# Altium project ttc2_project.prjpcb (part 1 of 2)
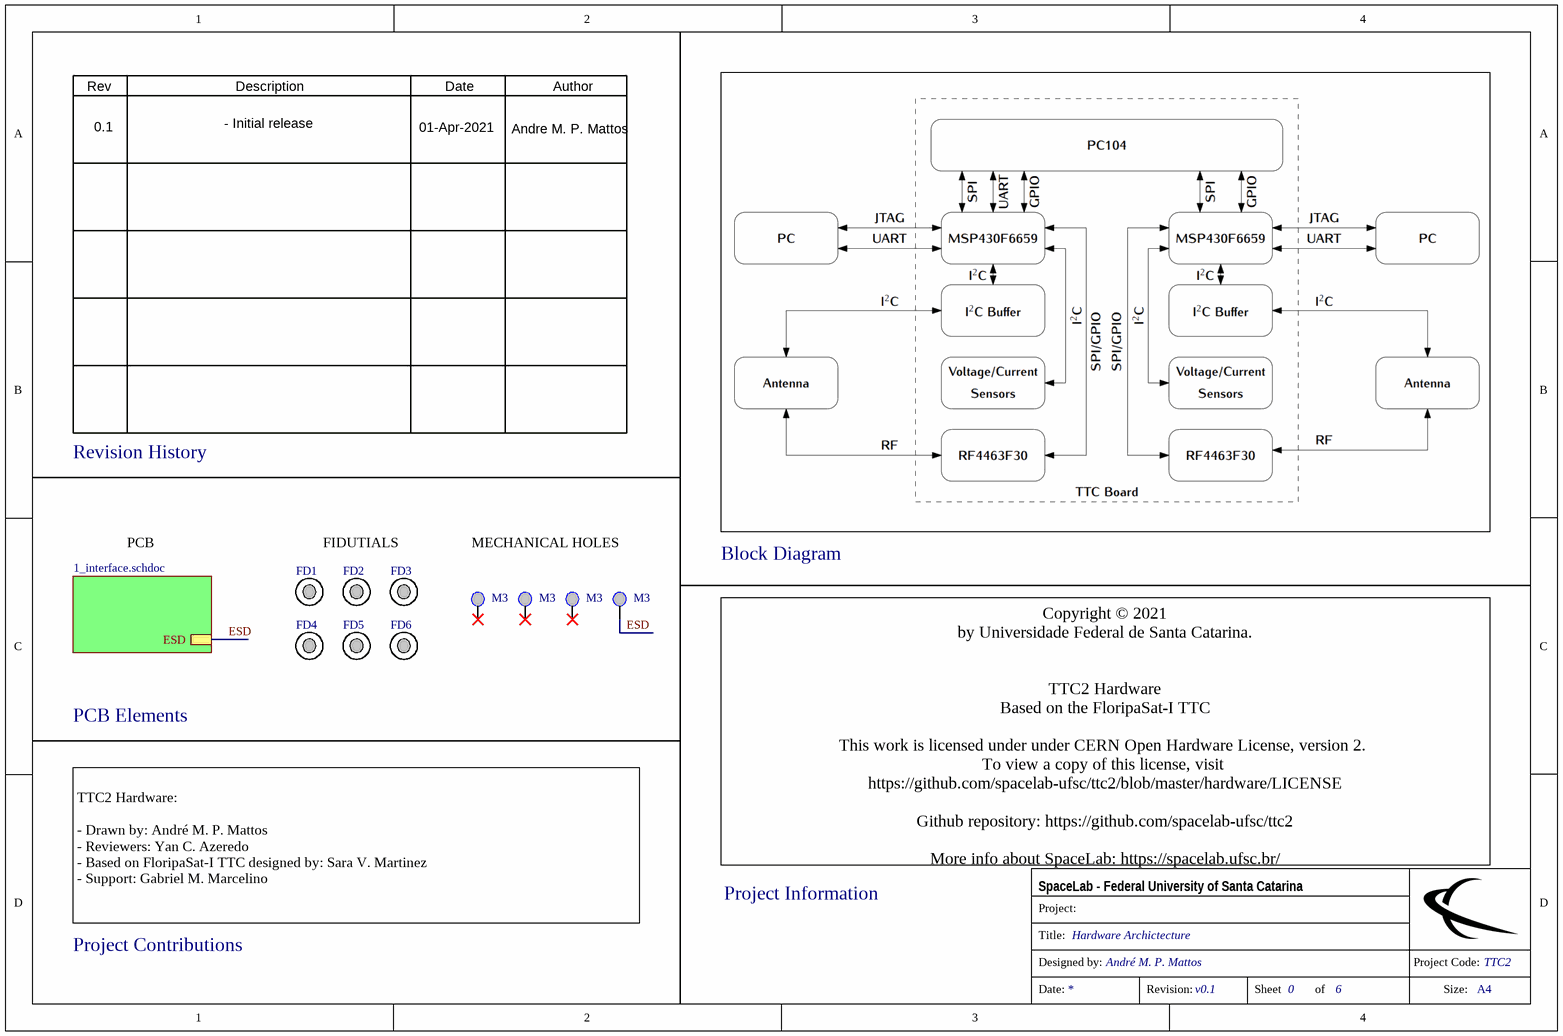
[diagram p0: 0_architecture.schdoc]
DesignedBy: André M. P. Mattos; ProjectCode: TTC2; ProjectRevision: v0.1
7 sheets, 168 parts. Net scope: hierarchical (ports join the sheet entries above them; power ports are global).
Board file: board_layout.pcbdoc
Sheets:
  0_architecture.schdoc
    Interface = 1_interface.schdoc
      INTERFACE = 2_topology.schdoc
        MCU RADIO 0 = 3_mcu_radio_0.schdoc
        Radio 0 (RF4463F30) = 5_radio_0.schdoc
        MCU RADIO 1 = 4_mcu_radio_1.schdoc
        Radio 1 (RF4463F30) = 6_radio_1.schdoc

## Sheet 0_architecture.schdoc: Hardware Archictecture
size A4; Revision: v0.1; SheetNumber: 0; SheetTotal: 6; ProjectCode: TTC2; Designed by: André M. P. Mattos; Version: v0.1

### Parts
FD1  Fiducial 1.3  [Fiducial 1.3mm]  (value not drawn)  (no BOM)
FD2  Fiducial 1.3  [Fiducial 1.3mm]  (value not drawn)  (no BOM)
FD3  Fiducial 1.3  [Fiducial 1.3mm]  (value not drawn)  (no BOM)
FD4  Fiducial 1.3  [Fiducial 1.3mm]  (value not drawn)  (no BOM)
FD5  Fiducial 1.3  [Fiducial 1.3mm]  (value not drawn)  (no BOM)
FD6  Fiducial 1.3  [Fiducial 1.3mm]  (value not drawn)  (no BOM)
MEC1  M3  [M3 hole]  (no BOM)
MEC2  M3  [M3 hole]  (no BOM)
MEC3  M3  [M3 hole]  (no BOM)
MEC4  M3  [M3 hole]  (no BOM)

### Sub-sheets
Interface = 1_interface.schdoc: ESD

### Nets
ESD: MEC4.0 ; sheet Interface/ESD

Not connected (* = marked no-connect by the designer): MEC1 0*; MEC2 0*; MEC3 0*

### Notes on the sheet
- Rev
- Description
- Date
- Author
- 0.1
- - Initial release
- 01-Apr-2021
- Andre M. P. Mattos
- Revision History
- PCB
- FIDUTIALS
- MECHANICAL HOLES
- Block Diagram
- PCB Elements
- TTC2 Hardware:
  - Drawn by: André M. P. Mattos
  - Reviewers: Yan C. Azeredo
  - Based on FloripaSat-I TTC designed by: Sara V. Martinez
  - Support: Gabriel M. Marcelino
- Copyright © 2021
  by Universidade Federal de Santa Catarina.
  TTC2 Hardware
  Based on the FloripaSat-I TTC
  This work is licensed under under CERN Open Hardware License, version 2.
  To view a copy of this license, visit
  https://github.com/spacelab-ufsc/ttc2/blob/master/hardware/LICENSE
  Github repository: https://github.com/spacelab-ufsc/ttc2
  More info about SpaceLab: https://spacelab.ufsc.br/
- Project Information
- Project Contributions
- Project:
- SpaceLab - Federal University of Santa Catarina
- Title:
- Designed by:
- Project Code:
- Date:
- Revision:
- Sheet
- of
- Size:
- A4

### Library data of the parts
FD1-FD6 = Fiducial 1.3: Fiducial 1.3mm
MEC1-MEC4 = M3 hole

## Sheet 1_interface.schdoc: Interface
size A3; DrawnBy: André M. P. Mattos; SheetNumber: 1; SheetTotal: 6; ProjectCode: TTC2; DesignedBy: André M. P. Mattos; ProjectRevision: v0.1; Rule: PcbType=ProtelPcb
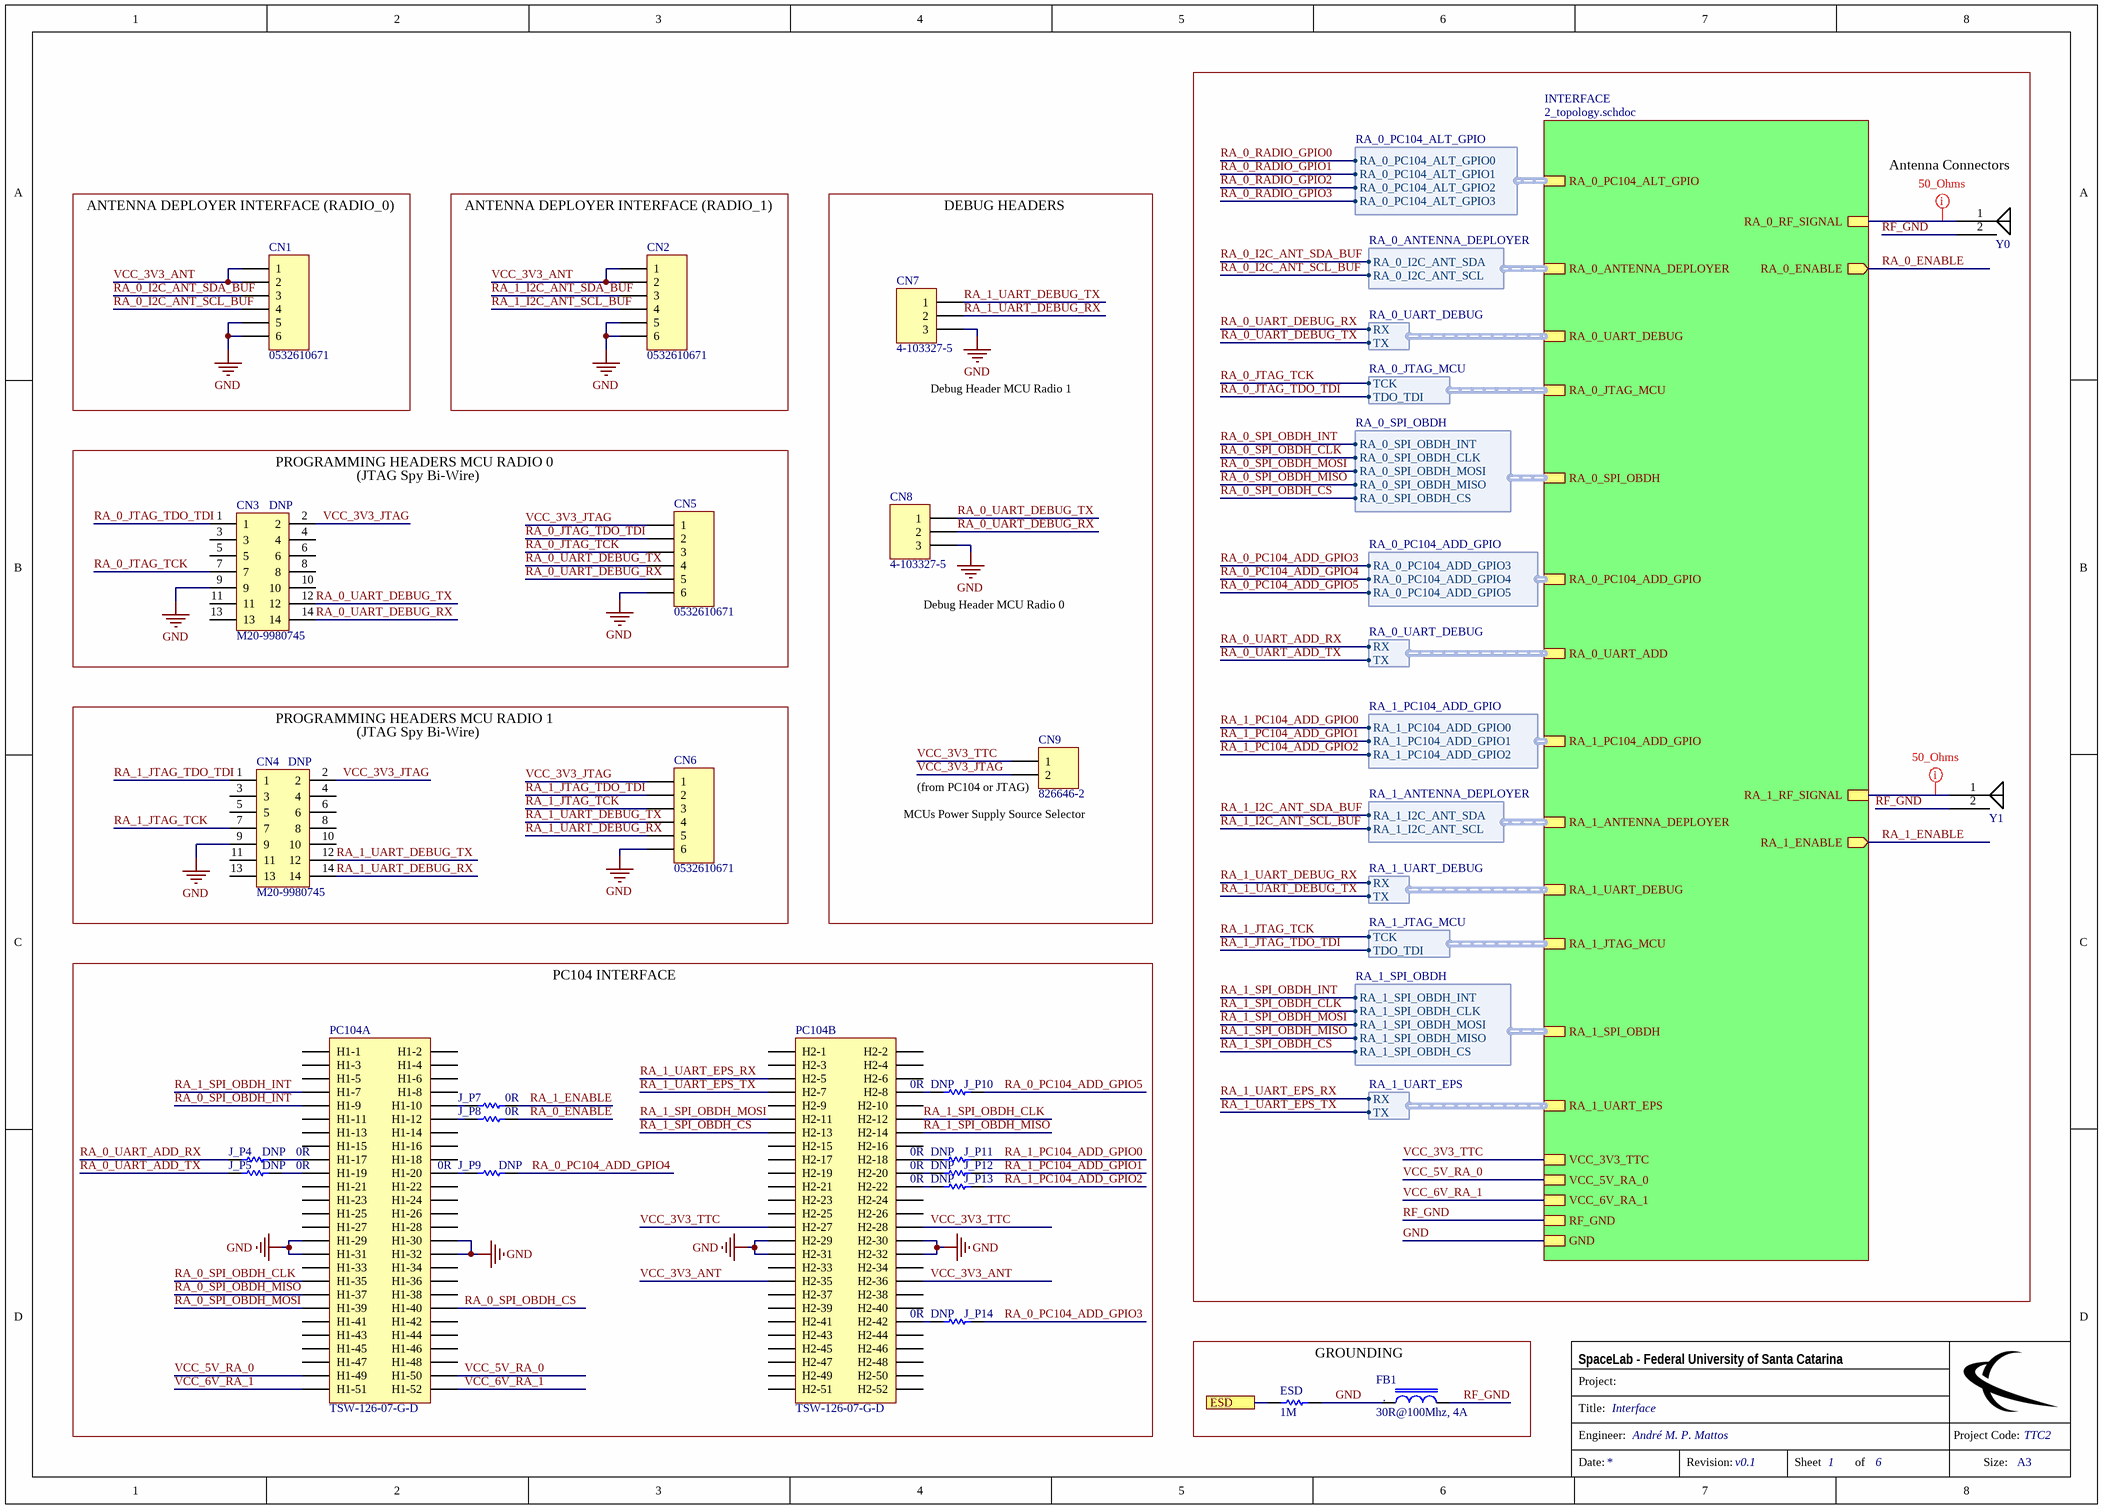
[diagram p1: 1_interface.schdoc]

### Parts
CN1  0532610671  [PICOBLADE 6PIN Right Angle]
CN2  0532610671  [PICOBLADE 6PIN Right Angle]
CN3  M20-9980745  [CONN HEADER VERT 14POS 2.54MM]
CN4  M20-9980745  [CONN HEADER VERT 14POS 2.54MM]
CN5  0532610671  [PICOBLADE 6PIN Right Angle]
CN6  0532610671  [PICOBLADE 6PIN Right Angle]
CN7  4-103327-5  [HDR 1X3]
CN8  4-103327-5  [HDR 1X3]
CN9  826646-2  [HDR 1X2]
ESD  1M  [0805]
FB1  30R@100Mhz, 4A  [IND0805]
J_P4  0R  [0805]
J_P5  0R  [0805]
J_P7  0R  [0805]
J_P8  0R  [0805]
J_P9  0R  [0805]
J_P10  0R  [0805]
J_P11  0R  [0805]
J_P12  0R  [0805]
J_P13  0R  [0805]
J_P14  0R  [0805]
PC104  TSW-126-07-G-D  [PC104_TTC]  (parts A,B of 2)
Y0  Coaxial_Connectors_90º  [CONN MCX JACK  R/A  50 OHM SMD]  (value not drawn)
Y1  Coaxial_Connectors_90º  [CONN MCX JACK  R/A  50 OHM SMD]  (value not drawn)

### Blocks framed on the sheet
Antenna Connectors: Y0 Y1
ANTENNA DEPLOYER INTERFACE (RADIO_0): CN1
ANTENNA DEPLOYER INTERFACE (RADIO_1): CN2
DEBUG HEADERS: CN7-CN9
PC104 INTERFACE: J_P4 J_P5 J_P7-J_P14 PC104
GROUNDING: ESD FB1

### Sub-sheets
INTERFACE = 2_topology.schdoc: RA_0_ANTENNA_DEPLOYER (harness RA_0_ANTENNA_DEPLOYER), RA_0_UART_DEBUG (harness RA_0_UART_DEBUG), RA_0_JTAG_MCU (harness RA_0_JTAG_MCU), RA_0_PC104_ALT_GPIO (harness RA_0_PC104_ALT_GPIO), RA_0_PC104_ADD_GPIO (harness RA_0_PC104_ADD_GPIO), RA_0_UART_ADD (harness RA_0_UART_DEBUG), RA_1_ANTENNA_DEPLOYER (harness RA_1_ANTENNA_DEPLOYER), RA_1_UART_DEBUG (harness RA_1_UART_DEBUG), RA_1_JTAG_MCU (harness RA_1_JTAG_MCU), RA_1_SPI_OBDH (harness RA_1_SPI_OBDH), RA_1_PC104_ADD_GPIO (harness RA_1_PC104_ADD_GPIO), RA_1_UART_EPS (harness RA_1_UART_EPS), RA_0_RF_SIGNAL, RA_1_RF_SIGNAL, RA_0_ENABLE (out), RA_1_ENABLE (out), VCC_3V3_TTC, VCC_5V_RA_0, VCC_6V_RA_1, RF_GND, GND, RA_0_SPI_OBDH (harness RA_0_SPI_OBDH)

### Ports
ESD

### Harnesses
RA_0_PC104_ALT_GPIO: RA_0_PC104_ALT_GPIO3, RA_0_PC104_ALT_GPIO2, RA_0_PC104_ALT_GPIO1, RA_0_PC104_ALT_GPIO0
RA_0_ANTENNA_DEPLOYER: RA_0_I2C_ANT_SCL, RA_0_I2C_ANT_SDA
RA_0_UART_DEBUG: TX, RX
RA_0_JTAG_MCU: TDO_TDI, TCK
RA_1_PC104_ADD_GPIO: RA_1_PC104_ADD_GPIO2, RA_1_PC104_ADD_GPIO1, RA_1_PC104_ADD_GPIO0
RA_1_ANTENNA_DEPLOYER: RA_1_I2C_ANT_SCL, RA_1_I2C_ANT_SDA
RA_1_UART_DEBUG: TX, RX
RA_1_JTAG_MCU: TDO_TDI, TCK
RA_1_SPI_OBDH: RA_1_SPI_OBDH_CLK, RA_1_SPI_OBDH_MOSI, RA_1_SPI_OBDH_MISO, RA_1_SPI_OBDH_CS, RA_1_SPI_OBDH_INT
RA_1_UART_EPS: TX, RX
RA_0_PC104_ADD_GPIO: RA_0_PC104_ADD_GPIO5, RA_0_PC104_ADD_GPIO4, RA_0_PC104_ADD_GPIO3
RA_0_SPI_OBDH: RA_0_SPI_OBDH_CLK, RA_0_SPI_OBDH_MOSI, RA_0_SPI_OBDH_MISO, RA_0_SPI_OBDH_CS, RA_0_SPI_OBDH_INT

### Nets
GND: CN1.5 CN1.6 CN2.5 CN2.6 CN3.9 CN4.9 CN5.6 CN6.6 CN7.3 CN8.3 ESD.1 FB1.1 PC104.H1-29 PC104.H1-30 PC104.H1-31 PC104.H1-32 PC104.H2-29 PC104.H2-30 PC104.H2-31 PC104.H2-32 ; sheet INTERFACE/GND
VCC_3V3_TTC: CN9.1 PC104.H2-27 PC104.H2-28 ; sheet INTERFACE/VCC_3V3_TTC
VCC_5V_RA_0: PC104.H1-49 PC104.H1-50 ; sheet INTERFACE/VCC_5V_RA_0
VCC_6V_RA_1: PC104.H1-51 PC104.H1-52 ; sheet INTERFACE/VCC_6V_RA_1
ESD: ESD.2 ; port ESD
RA_0_ENABLE: J_P8.1 ; sheet INTERFACE/RA_0_ENABLE
RA_0_I2C_ANT_SCL_BUF: CN1.4 ; sheet INTERFACE/RA_0_ANTENNA_DEPLOYER.RA_0_I2C_ANT_SCL
RA_0_I2C_ANT_SDA_BUF: CN1.3 ; sheet INTERFACE/RA_0_ANTENNA_DEPLOYER.RA_0_I2C_ANT_SDA
RA_0_JTAG_TCK: CN3.7 CN5.3 ; sheet INTERFACE/RA_0_JTAG_MCU.TCK
RA_0_JTAG_TDO_TDI: CN3.1 CN5.2 ; sheet INTERFACE/RA_0_JTAG_MCU.TDO_TDI
RA_0_PC104_ADD_GPIO3: J_P14.1 ; sheet INTERFACE/RA_0_PC104_ADD_GPIO.RA_0_PC104_ADD_GPIO3
RA_0_PC104_ADD_GPIO4: J_P9.1 ; sheet INTERFACE/RA_0_PC104_ADD_GPIO.RA_0_PC104_ADD_GPIO4
RA_0_PC104_ADD_GPIO5: J_P10.1 ; sheet INTERFACE/RA_0_PC104_ADD_GPIO.RA_0_PC104_ADD_GPIO5
RA_0_RF_SIGNAL: Y0.1 ; sheet INTERFACE/RA_0_RF_SIGNAL
RA_0_SPI_OBDH_CLK: PC104.H1-35 ; sheet INTERFACE/RA_0_SPI_OBDH.RA_0_SPI_OBDH_CLK
RA_0_SPI_OBDH_CS: PC104.H1-40 ; sheet INTERFACE/RA_0_SPI_OBDH.RA_0_SPI_OBDH_CS
RA_0_SPI_OBDH_INT: PC104.H1-9 ; sheet INTERFACE/RA_0_SPI_OBDH.RA_0_SPI_OBDH_INT
RA_0_SPI_OBDH_MISO: PC104.H1-37 ; sheet INTERFACE/RA_0_SPI_OBDH.RA_0_SPI_OBDH_MISO
RA_0_SPI_OBDH_MOSI: PC104.H1-39 ; sheet INTERFACE/RA_0_SPI_OBDH.RA_0_SPI_OBDH_MOSI
RA_0_UART_ADD_RX: J_P4.2 ; sheet INTERFACE/RA_0_UART_ADD.RX
RA_0_UART_ADD_TX: J_P5.2 ; sheet INTERFACE/RA_0_UART_ADD.TX
RA_0_UART_DEBUG_RX: CN3.14 CN5.5 CN8.2 ; sheet INTERFACE/RA_0_UART_DEBUG.RX
RA_0_UART_DEBUG_TX: CN3.12 CN5.4 CN8.1 ; sheet INTERFACE/RA_0_UART_DEBUG.TX
RA_1_ENABLE: J_P7.1 ; sheet INTERFACE/RA_1_ENABLE
RA_1_I2C_ANT_SCL_BUF: CN2.4 ; sheet INTERFACE/RA_1_ANTENNA_DEPLOYER.RA_1_I2C_ANT_SCL
RA_1_I2C_ANT_SDA_BUF: CN2.3 ; sheet INTERFACE/RA_1_ANTENNA_DEPLOYER.RA_1_I2C_ANT_SDA
RA_1_JTAG_TCK: CN4.7 CN6.3 ; sheet INTERFACE/RA_1_JTAG_MCU.TCK
RA_1_JTAG_TDO_TDI: CN4.1 CN6.2 ; sheet INTERFACE/RA_1_JTAG_MCU.TDO_TDI
RA_1_PC104_ADD_GPIO0: J_P11.1 ; sheet INTERFACE/RA_1_PC104_ADD_GPIO.RA_1_PC104_ADD_GPIO0
RA_1_PC104_ADD_GPIO1: J_P12.1 ; sheet INTERFACE/RA_1_PC104_ADD_GPIO.RA_1_PC104_ADD_GPIO1
RA_1_PC104_ADD_GPIO2: J_P13.1 ; sheet INTERFACE/RA_1_PC104_ADD_GPIO.RA_1_PC104_ADD_GPIO2
RA_1_RF_SIGNAL: Y1.1 ; sheet INTERFACE/RA_1_RF_SIGNAL
RA_1_SPI_OBDH_CLK: PC104.H2-12 ; sheet INTERFACE/RA_1_SPI_OBDH.RA_1_SPI_OBDH_CLK
RA_1_SPI_OBDH_CS: PC104.H2-13 ; sheet INTERFACE/RA_1_SPI_OBDH.RA_1_SPI_OBDH_CS
RA_1_SPI_OBDH_INT: PC104.H1-7 ; sheet INTERFACE/RA_1_SPI_OBDH.RA_1_SPI_OBDH_INT
RA_1_SPI_OBDH_MISO: PC104.H2-14 ; sheet INTERFACE/RA_1_SPI_OBDH.RA_1_SPI_OBDH_MISO
RA_1_SPI_OBDH_MOSI: PC104.H2-11 ; sheet INTERFACE/RA_1_SPI_OBDH.RA_1_SPI_OBDH_MOSI
RA_1_UART_DEBUG_RX: CN4.14 CN6.5 CN7.2 ; sheet INTERFACE/RA_1_UART_DEBUG.RX
RA_1_UART_DEBUG_TX: CN4.12 CN6.4 CN7.1 ; sheet INTERFACE/RA_1_UART_DEBUG.TX
RA_1_UART_EPS_RX: PC104.H2-5 ; sheet INTERFACE/RA_1_UART_EPS.RX
RA_1_UART_EPS_TX: PC104.H2-7 ; sheet INTERFACE/RA_1_UART_EPS.TX
RF_GND: FB1.2 Y0.2 Y1.2 ; sheet INTERFACE/RF_GND
VCC_3V3_ANT: CN1.1 CN1.2 CN2.1 CN2.2 PC104.H2-35 PC104.H2-36
VCC_3V3_JTAG: CN3.2 CN4.2 CN5.1 CN6.1 CN9.2
NetJ_P4_1: J_P4.1 PC104.H1-17
NetJ_P5_1: J_P5.1 PC104.H1-19
NetJ_P7_2: J_P7.2 PC104.H1-10
NetJ_P8_2: J_P8.2 PC104.H1-12
NetJ_P9_2: J_P9.2 PC104.H1-20
NetJ_P10_2: J_P10.2 PC104.H2-8
NetJ_P11_2: J_P11.2 PC104.H2-18
NetJ_P12_2: J_P12.2 PC104.H2-20
NetJ_P13_2: J_P13.2 PC104.H2-22
NetJ_P14_2: J_P14.2 PC104.H2-42

Not connected (* = marked no-connect by the designer): CN3 3 4 5 6 8 10 11 13; CN4 3 4 5 6 8 10 11 13; PC104 H1-1 H1-2 H1-3 H1-4 H1-5 H1-6 H1-8 H1-11 H1-13 H1-14 H1-15 H1-16 H1-18 H1-21 H1-22 H1-23 H1-24 H1-25 H1-26 H1-27 H1-28 H1-33 H1-34 H1-36 H1-38 H1-41 H1-42 H1-43 H1-44 H1-45 H1-46 H1-47 H1-48 H2-1 H2-2 H2-3 H2-4 H2-6 H2-9 H2-10 H2-15 H2-16 H2-17 H2-19 H2-21 H2-23 H2-24 H2-25 H2-26 H2-33 H2-34 H2-37 H2-38 H2-39 H2-40 H2-41 H2-43 H2-44 H2-45 H2-46 H2-47 H2-48 H2-49 H2-50 H2-51 H2-52

### Layout directives
net class 50Ohm_Net: RA_0_RF_SIGNAL, RA_1_RF_SIGNAL

### Notes on the sheet
- Debug Header MCU Radio 1
- (near CN3) DNP
- (near CN3) PROGRAMMING HEADERS MCU RADIO 0
- (JTAG Spy Bi-Wire)
- Debug Header MCU Radio 0
- (near CN4) PROGRAMMING HEADERS MCU RADIO 1
- (near CN4) DNP
- (near CN9) MCUs Power Supply Source Selector
- (near CN9) (from PC104 or JTAG)
- (near J_P10) DNP
- (near J_P4) DNP
- DNP
- (near J_P9) DNP
- (near J_P11) DNP
- (near J_P14) DNP
- Project:
- SpaceLab - Federal University of Santa Catarina
- Title:
- Engineer:
- Project Code:
- Date:
- Revision:
- Sheet
- of
- Size:
- A3
- (in symbol FB_30R_4A_100MHz_0805) .

### Library data of the parts
CN1 CN2 CN5 CN6 = 0532610671: PicoBlade 6 Position Right Angle Connector Header Surface Mount  0.049" (1.25mm); LatestRevisionDate: 17-Jul-2002; LatestRevisionNote: Re-released for DXP Platform.; Publisher: Altium Limited; Partnumber: 0532610671
CN3 CN4 = M20-9980745: Connector Header Through Hole 14 position 0.100" (2.54mm); Manufacturer: Harwin; Number of Contacts: 14; Contact Resistance: 25mR; Max Current Rating: 3A; Gender: Male; Connector Type: Male Pin; Row Spacing: 0.1inch; Supplier 1: Digi-Key; Supplier Part Number 1: 952-1932-ND; Stock 1: 15564; Pricing 1: 1=0.54, 10=0.51, 100=0.391, 500=0.34, 1000=0.2805, 5000=0.2465, 10000=0.2295 (USD); Mount: Through Hole; Contact Plating: Gold; Contact Material: Brass; Color: Black; Housing Color: Black; Housing Material: Nylon; Min Operating Temperature: -40°C; Max Operating Temperature: 105°C; Number of Rows: 2; Termination: Solder; Package Quantity: 500; Packaging: Bag; Number of Positions: 14; Orientation: Straight; Length: 17.78mm; Pitch: 2.54mm; Contact Mating Length: 0.24inch; Depth: 5.08mm; Radiation Hardening: No; REACH SVHC: No SVHC; ComponentLink1URL: https://www.verical.com/server-webapp/html/getDatasheet?partID=468550&src-supplier=Verical; ComponentLink1Description: https://www.verical.com/server-webapp/html/getDatasheet?partID=468550&src-supplier=Verical; ComponentLink2URL: http://www.harwin.com/include/downloads/drawings/M20-998.PDF?src-supplier=Element14; ComponentLink2Description: http://www.harwin.com/include/downloads/drawings/M20-998.PDF?src-supplier=Element14; ComponentLink3URL: http://www.mouser.com/ds/2/181/M20-998-351176.pdf?src-supplier=Mouser; ComponentLink3Description: http://www.mouser.com/ds/2/181/M20-998-351176.pdf?src-supplier=Mouser; Supplier 2: Mouser; Supplier Part Number 2: 855-M20-9980745; Stock 2: 1790; Pricing 2: 1=0.54, 10=0.51, 100=0.387, 500=0.34, 1000=0.28, 2500=0.246 (USD); Manufacturer Part Number: M20-9980745
CN7 CN8 = 4-103327-5: Connector Header Through Hole 3 position 0.100" (2.54mm); Manufacturer: TE Connectivity AMP; Number of Contacts: 3; Connector Type: Plug,Header,Pin; Current Rating: 3A; Insulation Resistance: 5GR; Board Standoff: No (Without); High Speed Serial Data Connector: No; PCB Mount Retention: Without; PCB Mounting Orientation: Vertical; Contact Post Length: 0.12inch; Approvals: CSA; Fitted: Yes (eng model only); LatestRevisionDate: 17-Jul-2002; LatestRevisionNote: Re-released for DXP Platform.; Publisher: Altium Limited; Partnumber: 4-103327-5; Supplier 1: Mouser; Supplier Part Number 1: 571-4-103327-5; Stock 1: 2961; Pricing 1: 1=0.26, 10=0.182, 100=0.157, 500=0.15, 1000=0.125, 2500=0.107 (USD); Mount: Through Hole; Contact Plating: Tin; Contact Material: Bronze; Housing Color: Black; Housing Material: Thermoplastic; Contact Shape: Square; Min Operating Temperature: -65°C; Max Operating Temperature: 105°C; Number of Rows: 1; Termination: Through Hole; Packaging: Carton; Package Quantity: 540; Number of Positions: 3; Contact Gender: Male; Orientation: Straight; Contact Protection: No (Without); Gasket: No (Without); High Temperature Housing: No; Keyed: No; Mating Connector Lock: No (Without); Selectively Loaded: No (Without); Stabilizers: No (Without); Strain Relief: No (Without); Contact Current Rating: 3A; Length: 7.21mm; Pitch: 2.54mm; Contact Mating Length: 0.23inch; Row Spacing: 2.54mm; Depth: 2.34mm; Radiation Hardening: No; ELV: Compliant; Flammability Rating: UL94 V-0; Supplier 2: Digi-Key; Supplier Part Number 2: A128778-ND; Stock 2: 16328; Pricing 2: 1=0.26, 10=0.25, 100=0.1753, 500=0.1503, 1000=0.12525, 5000=0.10736, 10000=0.1002 (USD); Manufacturer Part Number: 4-103327-5
CN9 = 826646-2: Connector Header Through Hole 2 position 0.100" (2.54mm); LatestRevisionDate: 17-Jul-2002; LatestRevisionNote: Re-released for DXP Platform.; Publisher: Altium Limited; PartNumber: 826646-2
ESD = R1000k_1%_1/8W_0805: RES 1000K OHM 1/8W 1% 0805; Partnumber: RMCF0805FG1M00; NCM: 8533.21.20
FB1 = FB_30R_4A_100MHz_0805: Ferrite Bead 30 OHM 4A 100MHz; Partnumber: BLM21PG300SN1D; NCM: 8504.50.00
J_P4 J_P5 J_P7-J_P14 = R0R_JUMPER_1/8W_0805: RES 0R OHM 1/8W JUMPER 0805; Partnumber: CRCW08050000Z0EA; NCM: 8533.21.20
PC104 = PC104_TTC: Connector Header Through Hole 52 position 0.100" (2.54mm) - PC104 used in the TTC module; Partnumber: SSW-126-04-G-D; Contact Length - Mating: 5.84mm; Overall Contact Length: 10.92mm; Contact Length - Post: 2.54mm; Insulation Height: 2.54mm; Contact Finish - Mating: Gold; Operating Temperature: -55°C ~ 125°C
Y0 Y1 = Coaxial_Connectors_90º: MCX Connector Jack, Female Socket 50Ohm Through Hole, Right Angle Solder; Partnumber: 133-3701-311

## Sheet 2_topology.schdoc: Topology
size A3; DrawnBy: André M. P. Mattos; Revision: v0.1; SheetNumber: 2; SheetTotal: 6; ProjectCode: TTC2; DesignedBy: André M. P. Mattos
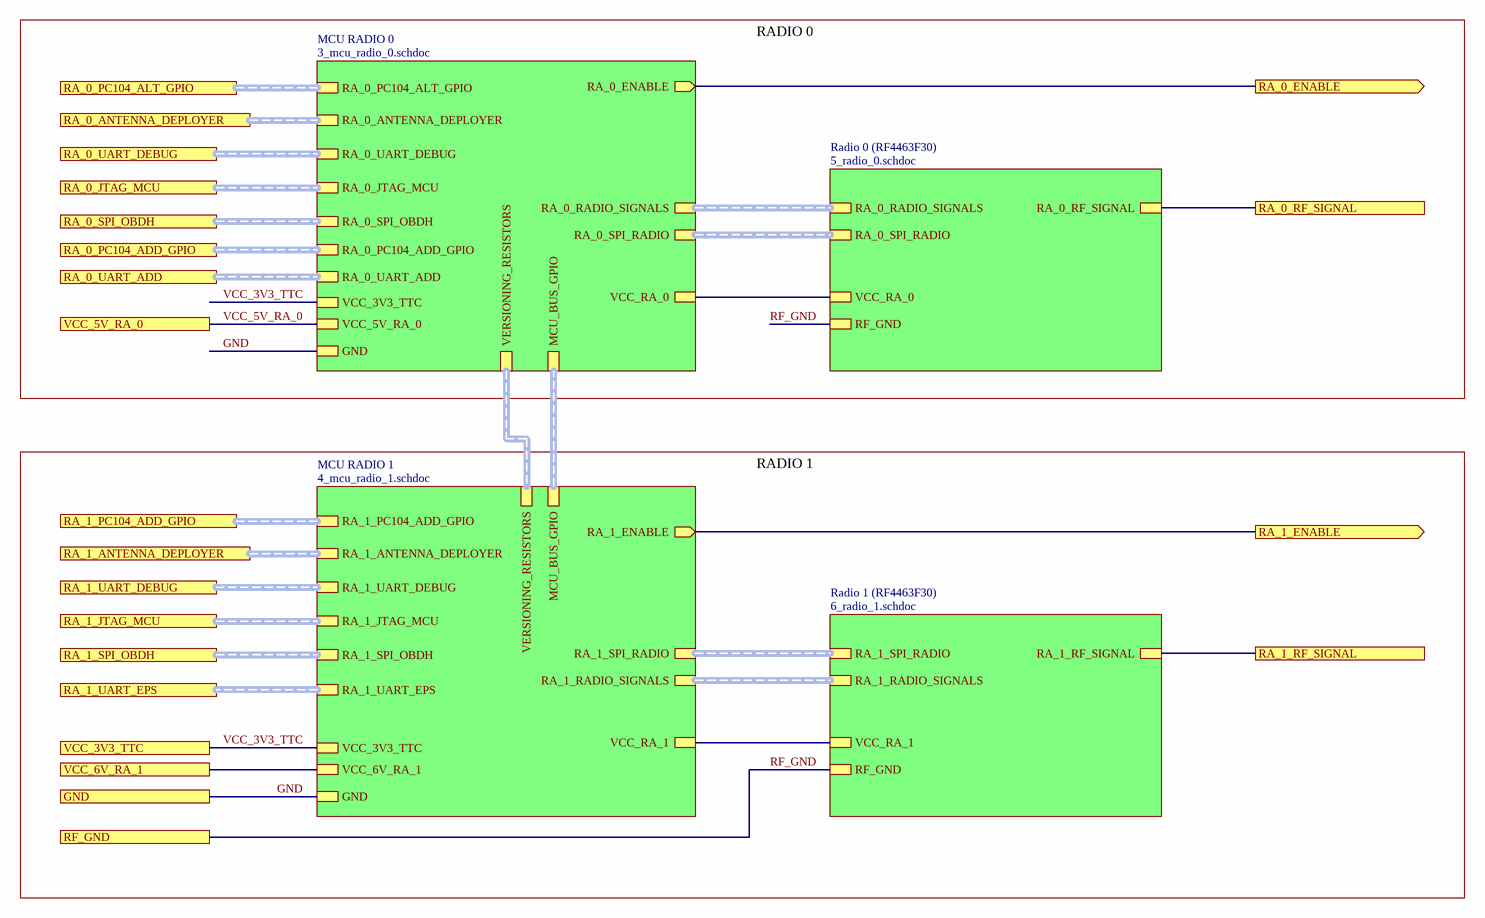
[diagram p2: 2_topology.schdoc]

### Sub-sheets
MCU RADIO 0 = 3_mcu_radio_0.schdoc: VCC_3V3_TTC, GND, RA_0_ENABLE (out), VCC_RA_0, VCC_5V_RA_0, RA_0_ANTENNA_DEPLOYER (harness RA_0_ANTENNA_DEPLOYER), RA_0_JTAG_MCU (harness RA_0_JTAG_MCU), RA_0_UART_DEBUG (harness RA_0_UART_DEBUG), RA_0_RADIO_SIGNALS (harness RA_0_RADIO_SIGNALS), RA_0_SPI_RADIO (harness RA_0_SPI_RADIO), VERSIONING_RESISTORS (harness VERSIONING_RESISTORS), MCU_BUS_GPIO (harness MCU_BUS_GPIO), RA_0_UART_ADD (harness RA_0_UART_ADD), RA_0_SPI_OBDH (harness RA_0_SPI_OBDH), RA_0_PC104_ALT_GPIO (harness RA_0_PC104_ALT_GPIO), RA_0_PC104_ADD_GPIO (harness RA_0_PC104_ADD_GPIO)
MCU RADIO 1 = 4_mcu_radio_1.schdoc: VCC_3V3_TTC, GND, RA_1_ENABLE (out), VCC_RA_1, VCC_6V_RA_1, RA_1_UART_EPS (harness RA_1_UART_EPS), RA_1_PC104_ADD_GPIO (harness RA_1_PC104_ADD_GPIO), RA_1_RADIO_SIGNALS (harness RA_1_RADIO_SIGNALS), RA_1_SPI_RADIO (harness RA_1_SPI_RADIO), RA_1_SPI_OBDH (harness RA_1_SPI_OBDH), VERSIONING_RESISTORS (harness VERSIONING_RESISTORS), RA_1_UART_DEBUG (harness RA_1_UART_DEBUG), RA_1_JTAG_MCU (harness RA_1_JTAG_MCU), RA_1_ANTENNA_DEPLOYER (harness RA_1_ANTENNA_DEPLOYER), MCU_BUS_GPIO (harness MCU_BUS_GPIO)
Radio 0 (RF4463F30) = 5_radio_0.schdoc: RF_GND, RA_0_RF_SIGNAL, VCC_RA_0, RA_0_RADIO_SIGNALS (harness RA_0_RADIO_SIGNALS), RA_0_SPI_RADIO (harness RA_0_SPI_RADIO)
Radio 1 (RF4463F30) = 6_radio_1.schdoc: RF_GND, RA_1_RF_SIGNAL, VCC_RA_1, RA_1_RADIO_SIGNALS (harness RA_1_RADIO_SIGNALS), RA_1_SPI_RADIO (harness RA_1_SPI_RADIO)

### Ports
GND, RA_0_ANTENNA_DEPLOYER (harness RA_0_ANTENNA_DEPLOYER), RA_0_ENABLE (out), RA_0_JTAG_MCU (harness RA_0_JTAG_MCU), RA_0_PC104_ADD_GPIO (harness RA_0_PC104_ADD_GPIO), RA_0_PC104_ALT_GPIO (harness RA_0_PC104_ALT_GPIO), RA_0_RF_SIGNAL, RA_0_SPI_OBDH (harness RA_0_SPI_OBDH), RA_0_UART_ADD (harness RA_0_UART_DEBUG), RA_0_UART_DEBUG (harness RA_0_UART_DEBUG), RA_1_ANTENNA_DEPLOYER (harness RA_1_ANTENNA_DEPLOYER), RA_1_ENABLE (out), RA_1_JTAG_MCU (harness RA_1_JTAG_MCU), RA_1_PC104_ADD_GPIO (harness RA_1_PC104_ADD_GPIO), RA_1_RF_SIGNAL, RA_1_SPI_OBDH (harness RA_1_SPI_OBDH), RA_1_UART_DEBUG (harness RA_1_UART_DEBUG), RA_1_UART_EPS (harness RA_1_UART_EPS), RF_GND, VCC_3V3_TTC, VCC_5V_RA_0, VCC_6V_RA_1

### Nets
GND: port GND, sheet MCU RADIO 0/GND, sheet MCU RADIO 1/GND
RA_0_SENSE_VCC_OUT1: sheet MCU RADIO 0/VCC_RA_0, sheet Radio 0 (RF4463F30)/VCC_RA_0
RA_1_SENSE_VCC_OUT1: sheet MCU RADIO 1/VCC_RA_1, sheet Radio 1 (RF4463F30)/VCC_RA_1
VCC_3V3_TTC: port VCC_3V3_TTC, sheet MCU RADIO 0/VCC_3V3_TTC, sheet MCU RADIO 1/VCC_3V3_TTC
VCC_5V_RA_0: port VCC_5V_RA_0, sheet MCU RADIO 0/VCC_5V_RA_0
VCC_6V_RA_1: port VCC_6V_RA_1, sheet MCU RADIO 1/VCC_6V_RA_1
RA_0_ENABLE: port RA_0_ENABLE, sheet MCU RADIO 0/RA_0_ENABLE
RA_0_RF_SIGNAL: port RA_0_RF_SIGNAL, sheet Radio 0 (RF4463F30)/RA_0_RF_SIGNAL
RA_1_ENABLE: port RA_1_ENABLE, sheet MCU RADIO 1/RA_1_ENABLE
RA_1_RF_SIGNAL: port RA_1_RF_SIGNAL, sheet Radio 1 (RF4463F30)/RA_1_RF_SIGNAL
RF_GND: port RF_GND, sheet Radio 0 (RF4463F30)/RF_GND, sheet Radio 1 (RF4463F30)/RF_GND

### Buses and harness runs
harness port RA_0_ANTENNA_DEPLOYER = sheet MCU RADIO 0/RA_0_ANTENNA_DEPLOYER
harness port RA_0_JTAG_MCU = sheet MCU RADIO 0/RA_0_JTAG_MCU
harness port RA_0_PC104_ADD_GPIO = sheet MCU RADIO 0/RA_0_PC104_ADD_GPIO
harness port RA_0_PC104_ALT_GPIO = sheet MCU RADIO 0/RA_0_PC104_ALT_GPIO
harness port RA_0_SPI_OBDH = sheet MCU RADIO 0/RA_0_SPI_OBDH
harness port RA_0_UART_ADD = sheet MCU RADIO 0/RA_0_UART_ADD
harness port RA_0_UART_DEBUG = sheet MCU RADIO 0/RA_0_UART_DEBUG
harness port RA_1_ANTENNA_DEPLOYER = sheet MCU RADIO 1/RA_1_ANTENNA_DEPLOYER
harness port RA_1_JTAG_MCU = sheet MCU RADIO 1/RA_1_JTAG_MCU
harness port RA_1_PC104_ADD_GPIO = sheet MCU RADIO 1/RA_1_PC104_ADD_GPIO
harness port RA_1_SPI_OBDH = sheet MCU RADIO 1/RA_1_SPI_OBDH
harness port RA_1_UART_DEBUG = sheet MCU RADIO 1/RA_1_UART_DEBUG
harness port RA_1_UART_EPS = sheet MCU RADIO 1/RA_1_UART_EPS
harness sheet MCU RADIO 0/MCU_BUS_GPIO = sheet MCU RADIO 1/MCU_BUS_GPIO
harness sheet MCU RADIO 0/RA_0_RADIO_SIGNALS = sheet Radio 0 (RF4463F30)/RA_0_RADIO_SIGNALS
harness sheet MCU RADIO 0/RA_0_SPI_RADIO = sheet Radio 0 (RF4463F30)/RA_0_SPI_RADIO
harness sheet MCU RADIO 0/VERSIONING_RESISTORS = sheet MCU RADIO 1/VERSIONING_RESISTORS
harness sheet MCU RADIO 1/RA_1_RADIO_SIGNALS = sheet Radio 1 (RF4463F30)/RA_1_RADIO_SIGNALS
harness sheet MCU RADIO 1/RA_1_SPI_RADIO = sheet Radio 1 (RF4463F30)/RA_1_SPI_RADIO

### Notes on the sheet
- RADIO 0
- RADIO 1
- Project:
- SpaceLab - Federal University of Santa Catarina
- Title:
- Engineer:
- Project Code:
- Date:
- Revision:
- Sheet
- of
- Size:
- A3

## Sheet 3_mcu_radio_0.schdoc: MCU Radio 0
size A3; DrawnBy: Sara Vega Martinez; Revision: v0.1; SheetNumber: 3; SheetTotal: 6; DesignedBy: André M. P. Mattos; ProjectRevision: v0.1
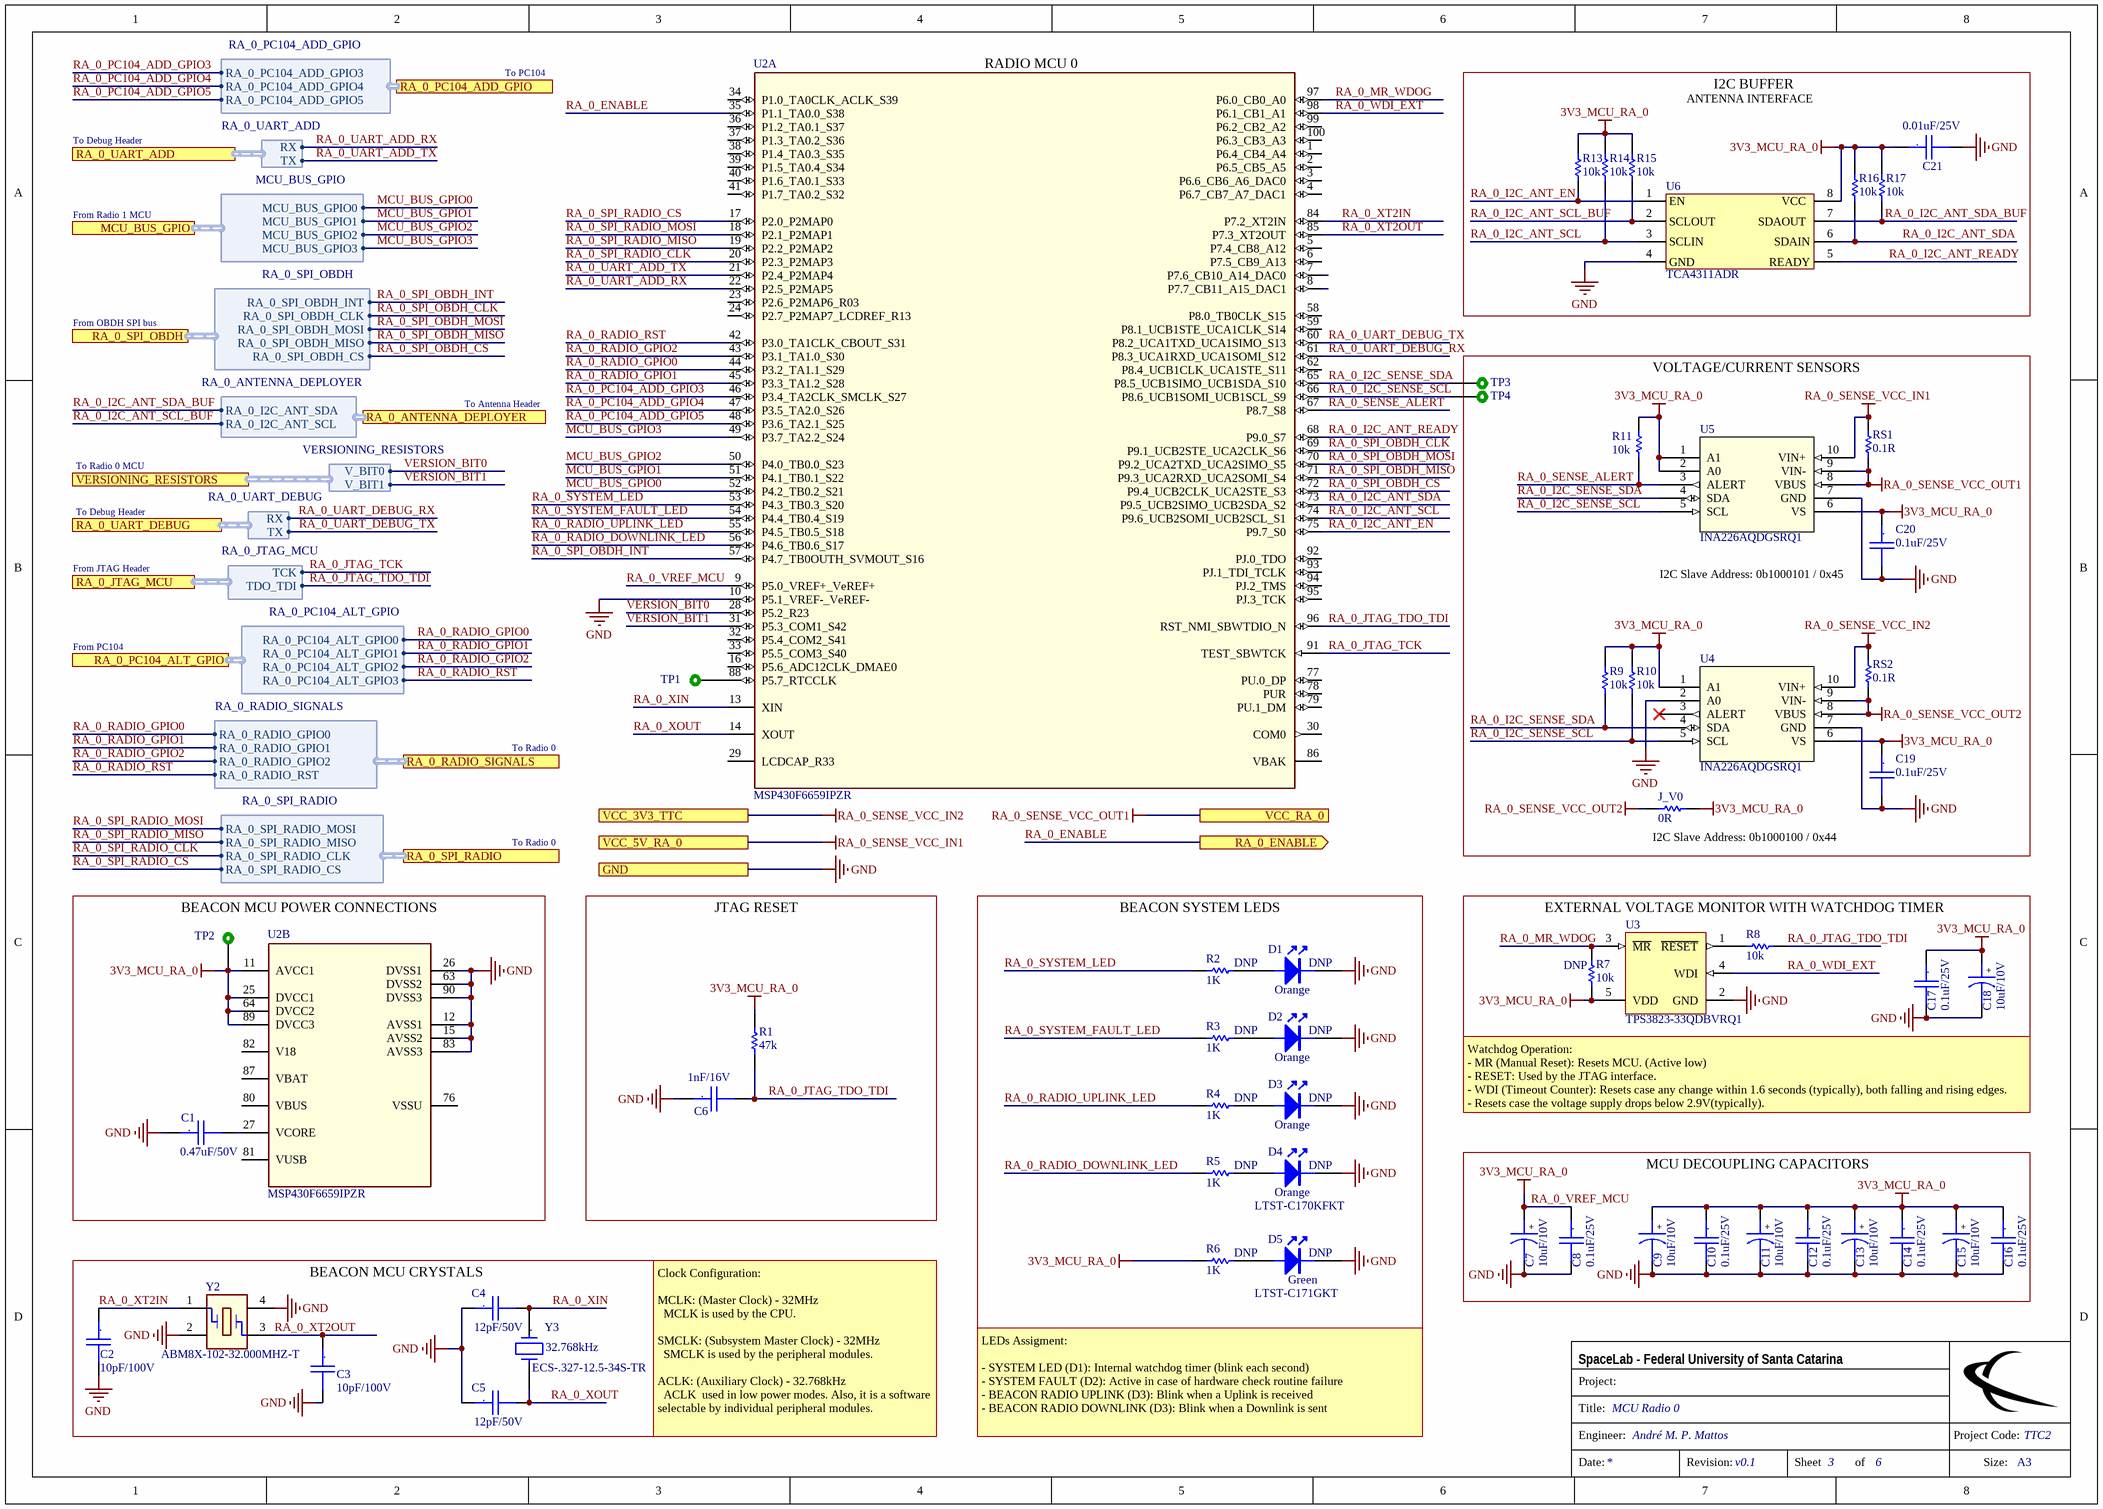
[diagram p3: 3_mcu_radio_0.schdoc]

### Parts
C1  0.47uF/50V  [CC0805]
C2  10pF/100V  [CC0805]
C3  10pF/100V  [CC0805]
C4  12pF/50V  [CC0805]
C5  12pF/50V  [CC0805]
C6  1nF/16V  [CC0603]
C7  10uF/10V  [CC0805_Tantalum]
C8  0.1uF/25V  [CC0805]
C9  10uF/10V  [CC0805_Tantalum]
C10  0.1uF/25V  [CC0805]
C11  10uF/10V  [CC0805_Tantalum]
C12  0.1uF/25V  [CC0805]
C13  10uF/10V  [CC0805_Tantalum]
C14  0.1uF/25V  [CC0805]
C15  10uF/10V  [CC0805_Tantalum]
C16  0.1uF/25V  [CC0805]
C17  0.1uF/25V  [CC0805]
C18  10uF/10V  [CC0805_Tantalum]
C19  0.1uF/25V  [CC0805]
C20  0.1uF/25V  [CC0805]
C21  0.01uF/25V  [CC0805]
D1  LTST-C170KFKT  [0805-ORANGE-LED]  (value not drawn)
D2  LTST-C170KFKT  [0805-ORANGE-LED]  (value not drawn)
D3  LTST-C170KFKT  [0805-ORANGE-LED]  (value not drawn)
D4  LTST-C170KFKT  [0805-ORANGE-LED]
D5  LTST-C171GKT  [0805-GREEN-LED]
J_V0  0R  [0805]
R1  47k  [0805]
R2  1K  [0805]
R3  1K  [0805]
R4  1K  [0805]
R5  1K  [0805]
R6  1K  [0805]
R7  10k  [0805]
R8  10k  [0805]
R9  10k  [0805]
R10  10k  [0805]
R11  10k  [0805]
R13  10k  [0805]
R14  10k  [0805]
R15  10k  [0805]
R16  10k  [0805]
R17  10k  [0805]
RS1  0.1R  [0805]
RS2  0.1R  [0805]
TP1  TEST_POINT  [TEST_POINT]  (value not drawn)  (no BOM)
TP2  TEST_POINT  [TEST_POINT]  (value not drawn)  (no BOM)
TP3  TEST_POINT  [TEST_POINT]  (value not drawn)  (no BOM)
TP4  TEST_POINT  [TEST_POINT]  (value not drawn)  (no BOM)
U2  MSP430F6659IPZR  [LQFP-100]  (parts A,B of 2)
U3  TPS3823-33QDBVRQ1  [DBV0005A_N]
U4  INA226AQDGSRQ1  [DGS10]
U5  INA226AQDGSRQ1  [DGS10]
U6  TCA4311ADR  [SOIC8]
Y2  ABM8X-102-32.000MHZ-T  [XTAL_ABM8X]
Y3  ECS-.327-12.5-34S-TR  [ABS06 0805]

### Blocks framed on the sheet
I2C BUFFER: C21 R13-R17 U6
VOLTAGE/CURRENT SENSORS: C19 C20 J_V0 R9-R11 RS1 RS2 TP3 TP4 U4 U5
BEACON MCU POWER CONNECTIONS: C1 TP2 U2
JTAG RESET: C6 R1
BEACON SYSTEM LEDS: D1-D5 R2-R6
EXTERNAL VOLTAGE MONITOR WITH WATCHDOG TIMER: C17 C18 R7 R8 U3
MCU DECOUPLING CAPACITORS: C7-C16
BEACON MCU CRYSTALS: C2-C5 Y2 Y3

### Ports
GND, MCU_BUS_GPIO (harness MCU_BUS_GPIO), RA_0_ANTENNA_DEPLOYER (harness RA_0_ANTENNA_DEPLOYER), RA_0_ENABLE (out), RA_0_JTAG_MCU (harness RA_0_JTAG_MCU), RA_0_PC104_ADD_GPIO (harness RA_0_PC104_ADD_GPIO), RA_0_PC104_ALT_GPIO (harness RA_0_PC104_ALT_GPIO), RA_0_RADIO_SIGNALS (harness RA_0_RADIO_SIGNALS), RA_0_SPI_OBDH (harness RA_0_SPI_OBDH), RA_0_SPI_RADIO (harness RA_0_SPI_RADIO), RA_0_UART_ADD (harness RA_0_UART_ADD), RA_0_UART_DEBUG (harness RA_0_UART_DEBUG), VCC_3V3_TTC, VCC_5V_RA_0, VCC_RA_0, VERSIONING_RESISTORS (harness VERSIONING_RESISTORS)

### Harnesses
RA_0_ANTENNA_DEPLOYER: RA_0_I2C_ANT_SCL, RA_0_I2C_ANT_SDA
RA_0_JTAG_MCU: TDO_TDI, TCK
RA_0_UART_DEBUG: RX, TX
RA_0_RADIO_SIGNALS: RA_0_RADIO_GPIO2, RA_0_RADIO_RST, RA_0_RADIO_GPIO0, RA_0_RADIO_GPIO1
RA_0_SPI_RADIO: RA_0_SPI_RADIO_CLK, RA_0_SPI_RADIO_MISO, RA_0_SPI_RADIO_MOSI, RA_0_SPI_RADIO_CS
RA_0_SPI_OBDH: RA_0_SPI_OBDH_CLK, RA_0_SPI_OBDH_MOSI, RA_0_SPI_OBDH_MISO, RA_0_SPI_OBDH_CS, RA_0_SPI_OBDH_INT
MCU_BUS_GPIO: MCU_BUS_GPIO0, MCU_BUS_GPIO1, MCU_BUS_GPIO2, MCU_BUS_GPIO3
RA_0_PC104_ALT_GPIO: RA_0_PC104_ALT_GPIO0, RA_0_PC104_ALT_GPIO1, RA_0_PC104_ALT_GPIO2, RA_0_PC104_ALT_GPIO3
VERSIONING_RESISTORS: V_BIT0, V_BIT1
RA_0_UART_ADD: RX, TX
RA_0_PC104_ADD_GPIO: RA_0_PC104_ADD_GPIO5, RA_0_PC104_ADD_GPIO4, RA_0_PC104_ADD_GPIO3

### Nets
GND: C1.1 C2.2 C3.2 C4.1 C5.1 C6.1 C7.2 C8.2 C9.2 C10.2 C11.2 C12.2 C13.2 C14.2 C15.2 C16.2 C17.2 C18.2 C19.2 C20.2 C21.2 D1.2(K) D2.2(K) D3.2(K) D4.2(K) D5.2(K) U2.10(P5.1_VREF-_VeREF-) U2.12(AVSS1) U2.15(AVSS2) U2.26(DVSS1) U2.63(DVSS2) U2.83(AVSS3) U2.90(DVSS3) U3.2(GND) U4.2(A0) U4.7(GND) U5.7(GND) U6.4(GND) Y2.2 Y2.4 ; port GND
RA_0_SENSE_VCC_IN1: RS1.2 U5.10(VIN+) ; port VCC_5V_RA_0  [project net VCC_5V_RA_0]
RA_0_SENSE_VCC_IN2: RS2.2 U4.10(VIN+) ; port VCC_3V3_TTC  [project net VCC_3V3_TTC]
RA_0_SENSE_VCC_OUT1: RS1.1 U5.8(VBUS) U5.9(VIN-) ; port VCC_RA_0
RA_0_SENSE_VCC_OUT2: J_V0.2 RS2.1 U4.8(VBUS) U4.9(VIN-)
RA_0_VREF_MCU: C7.1 C8.1 C9.1 C10.1 C11.1 C12.1 C13.1 C14.1 C15.1 C16.1 C17.1 C18.1 C19.1 C20.1 C21.1 J_V0.1 R1.2 R6.2 R7.1 R9.2 R10.2 R11.2 R13.2 R14.2 R15.2 R16.2 R17.2 TP2.1 U2.9(P5.0_VREF+_VeREF+) U2.11(AVCC1) U2.25(DVCC1) U2.64(DVCC2) U2.89(DVCC3) U3.5(VDD) U4.1(A1) U4.6(VS) U5.1(A1) U5.2(A0) U5.6(VS) U6.8(VCC)  [also labelled 3V3_MCU_RA_0]
MCU_BUS_GPIO0: U2.52(P4.2_TB0.2_S21) ; port MCU_BUS_GPIO.MCU_BUS_GPIO0
MCU_BUS_GPIO1: U2.51(P4.1_TB0.1_S22) ; port MCU_BUS_GPIO.MCU_BUS_GPIO1
MCU_BUS_GPIO2: U2.50(P4.0_TB0.0_S23) ; port MCU_BUS_GPIO.MCU_BUS_GPIO2
MCU_BUS_GPIO3: U2.49(P3.7_TA2.2_S24) ; port MCU_BUS_GPIO.MCU_BUS_GPIO3
RA_0_ENABLE: U2.35(P1.1_TA0.0_S38) ; port RA_0_ENABLE
RA_0_I2C_ANT_EN: R13.1 U2.75(P9.7_S0) U6.1(EN)
RA_0_I2C_ANT_READY: U2.68(P9.0_S7) U6.5(READY)
RA_0_I2C_ANT_SCL: R14.1 U2.74(P9.6_UCB2SOMI_UCB2SCL_S1) U6.3(SCLIN)
RA_0_I2C_ANT_SCL_BUF: R15.1 U6.2(SCLOUT) ; port RA_0_ANTENNA_DEPLOYER.RA_0_I2C_ANT_SCL
RA_0_I2C_ANT_SDA: R16.1 U2.73(P9.5_UCB2SIMO_UCB2SDA_S2) U6.6(SDAIN)
RA_0_I2C_ANT_SDA_BUF: R17.1 U6.7(SDAOUT) ; port RA_0_ANTENNA_DEPLOYER.RA_0_I2C_ANT_SDA
RA_0_I2C_SENSE_SCL: R10.1 TP4.1 U2.66(P8.6_UCB1SOMI_UCB1SCL_S9) U4.5(SCL) U5.5(SCL)
RA_0_I2C_SENSE_SDA: R9.1 TP3.1 U2.65(P8.5_UCB1SIMO_UCB1SDA_S10) U4.4(SDA) U5.4(SDA)
RA_0_JTAG_TCK: U2.91(TEST_SBWTCK) ; port RA_0_JTAG_MCU.TCK
RA_0_JTAG_TDO_TDI: C6.2 R1.1 R8.1 U2.96(RST_NMI_SBWTDIO_N) ; port RA_0_JTAG_MCU.TDO_TDI
RA_0_MR_WDOG: R7.2 U2.97(P6.0_CB0_A0) U3.3(~{MR})
RA_0_PC104_ADD_GPIO3: U2.46(P3.4_TA2CLK_SMCLK_S27) ; port RA_0_PC104_ADD_GPIO.RA_0_PC104_ADD_GPIO3
RA_0_PC104_ADD_GPIO4: U2.47(P3.5_TA2.0_S26) ; port RA_0_PC104_ADD_GPIO.RA_0_PC104_ADD_GPIO4
RA_0_PC104_ADD_GPIO5: U2.48(P3.6_TA2.1_S25) ; port RA_0_PC104_ADD_GPIO.RA_0_PC104_ADD_GPIO5
RA_0_RADIO_DOWNLINK_LED: R5.2 U2.56(P4.6_TB0.6_S17)
RA_0_RADIO_GPIO0: U2.44(P3.2_TA1.1_S29) ; port RA_0_RADIO_SIGNALS.RA_0_RADIO_GPIO0, port RA_0_PC104_ALT_GPIO.RA_0_PC104_ALT_GPIO0
RA_0_RADIO_GPIO1: U2.45(P3.3_TA1.2_S28) ; port RA_0_RADIO_SIGNALS.RA_0_RADIO_GPIO1, port RA_0_PC104_ALT_GPIO.RA_0_PC104_ALT_GPIO1
RA_0_RADIO_GPIO2: U2.43(P3.1_TA1.0_S30) ; port RA_0_RADIO_SIGNALS.RA_0_RADIO_GPIO2, port RA_0_PC104_ALT_GPIO.RA_0_PC104_ALT_GPIO2
RA_0_RADIO_RST: U2.42(P3.0_TA1CLK_CBOUT_S31) ; port RA_0_RADIO_SIGNALS.RA_0_RADIO_RST, port RA_0_PC104_ALT_GPIO.RA_0_PC104_ALT_GPIO3  [project net RA_0_RADIO_GPIO3]
RA_0_RADIO_UPLINK_LED: R4.2 U2.55(P4.5_TB0.5_S18)
RA_0_SENSE_ALERT: R11.1 U2.67(P8.7_S8) U5.3(ALERT)
RA_0_SPI_OBDH_CLK: U2.69(P9.1_UCB2STE_UCA2CLK_S6) ; port RA_0_SPI_OBDH.RA_0_SPI_OBDH_CLK
RA_0_SPI_OBDH_CS: U2.72(P9.4_UCB2CLK_UCA2STE_S3) ; port RA_0_SPI_OBDH.RA_0_SPI_OBDH_CS
RA_0_SPI_OBDH_INT: U2.57(P4.7_TB0OUTH_SVMOUT_S16) ; port RA_0_SPI_OBDH.RA_0_SPI_OBDH_INT
RA_0_SPI_OBDH_MISO: U2.71(P9.3_UCA2RXD_UCA2SOMI_S4) ; port RA_0_SPI_OBDH.RA_0_SPI_OBDH_MISO
RA_0_SPI_OBDH_MOSI: U2.70(P9.2_UCA2TXD_UCA2SIMO_S5) ; port RA_0_SPI_OBDH.RA_0_SPI_OBDH_MOSI
RA_0_SPI_RADIO_CLK: U2.20(P2.3_P2MAP3) ; port RA_0_SPI_RADIO.RA_0_SPI_RADIO_CLK
RA_0_SPI_RADIO_CS: U2.17(P2.0_P2MAP0) ; port RA_0_SPI_RADIO.RA_0_SPI_RADIO_CS
RA_0_SPI_RADIO_MISO: U2.19(P2.2_P2MAP2) ; port RA_0_SPI_RADIO.RA_0_SPI_RADIO_MISO
RA_0_SPI_RADIO_MOSI: U2.18(P2.1_P2MAP1) ; port RA_0_SPI_RADIO.RA_0_SPI_RADIO_MOSI
RA_0_SYSTEM_FAULT_LED: R3.2 U2.54(P4.4_TB0.4_S19)
RA_0_SYSTEM_LED: R2.2 U2.53(P4.3_TB0.3_S20)
RA_0_UART_ADD_RX: U2.22(P2.5_P2MAP5) ; port RA_0_UART_ADD.RX
RA_0_UART_ADD_TX: U2.21(P2.4_P2MAP4) ; port RA_0_UART_ADD.TX
RA_0_UART_DEBUG_RX: U2.61(P8.3_UCA1RXD_UCA1SOMI_S12) ; port RA_0_UART_DEBUG.RX
RA_0_UART_DEBUG_TX: U2.60(P8.2_UCA1TXD_UCA1SIMO_S13) ; port RA_0_UART_DEBUG.TX
RA_0_WDI_EXT: U2.98(P6.1_CB1_A1) U3.4(WDI)
RA_0_XIN: C4.2 U2.13(XIN) Y3.1
RA_0_XOUT: C5.2 U2.14(XOUT) Y3.2
RA_0_XT2IN: C2.1 U2.84(P7.2_XT2IN) Y2.1
RA_0_XT2OUT: C3.1 U2.85(P7.3_XT2OUT) Y2.3
VERSION_BIT0: U2.28(P5.2_R23) ; port VERSIONING_RESISTORS.V_BIT0
VERSION_BIT1: U2.31(P5.3_COM1_S42) ; port VERSIONING_RESISTORS.V_BIT1
NetC1_2: C1.2 U2.27(VCORE)
NetD1_1: D1.1(A) R2.1
NetD2_1: D2.1(A) R3.1
NetD3_1: D3.1(A) R4.1
NetD4_1: D4.1(A) R5.1
NetD5_1: D5.1(A) R6.1
NetR8_2: R8.2 U3.1(~{RESET})
NetTP1_1: TP1.1 U2.88(P5.7_RTCCLK)

Not connected (* = marked no-connect by the designer): U2 1(P6.4_CB4_A4) 2(P6.5_CB5_A5) 3(P6.6_CB6_A6_DAC0) 4(P6.7_CB7_A7_DAC1) 5(P7.4_CB8_A12) 6(P7.5_CB9_A13) 7(P7.6_CB10_A14_DAC0) 8(P7.7_CB11_A15_DAC1) 16(P5.6_ADC12CLK_DMAE0) 23(P2.6_P2MAP6_R03) 24(P2.7_P2MAP7_LCDREF_R13) 29(LCDCAP_R33) 30(COM0) 32(P5.4_COM2_S41) 33(P5.5_COM3_S40) 34(P1.0_TA0CLK_ACLK_S39) 36(P1.2_TA0.1_S37) 37(P1.3_TA0.2_S36) 38(P1.4_TA0.3_S35) 39(P1.5_TA0.4_S34) 40(P1.6_TA0.1_S33) 41(P1.7_TA0.2_S32) 58(P8.0_TB0CLK_S15) 59(P8.1_UCB1STE_UCA1CLK_S14) 62(P8.4_UCB1CLK_UCA1STE_S11) 76(VSSU) 77(PU.0_DP) 78(PUR) 79(PU.1_DM) 80(VBUS) 81(VUSB) 82(V18) 86(VBAK) 87(VBAT) 92(PJ.0_TDO) 93(PJ.1_TDI_TCLK) 94(PJ.2_TMS) 95(PJ.3_TCK) 99(P6.2_CB2_A2) 100(P6.3_CB3_A3); U4 3(ALERT)*

### Notes on the sheet
- To PC104
- (near U2) RADIO MCU 0
- ANTENNA INTERFACE
- To Debug Header
- From Radio 1 MCU
- From OBDH SPI bus
- To Antenna Header
- To Radio 0 MCU
- From JTAG Header
- I2C Slave Address: 0b1000101 / 0x45
- From PC104
- To Radio 0
- (near J_V0) I2C Slave Address: 0b1000100 / 0x44
- (near R2) DNP
- (near D1) DNP
- (near R7) DNP
- (near R3) DNP
- (near D2) DNP
- (near R4) DNP
- (near D3) DNP
- Watchdog Operation:
  - MR (Manual Reset): Resets MCU. (Active low)
  - RESET: Used by the JTAG interface.
  - WDI (Timeout Counter): Resets case any change within 1.6 seconds (typically), both falling and rising edges.
  - Resets case the voltage supply drops below 2.9V(typically).
- (near R5) DNP
- (near D4) DNP
- (near R6) DNP
- (near D5) DNP
- (near Y3) 32.768kHz
- Clock Configuration:
  MCLK: (Master Clock) - 32MHz
  MCLK is used by the CPU.
  SMCLK: (Subsystem Master Clock) - 32MHz
  SMCLK is used by the peripheral modules.
  ACLK: (Auxiliary Clock) - 32.768kHz
  ACLK  used in low power modes. Also, it is a software selectable by individual peripheral modules.
- LEDs Assigment:
  - SYSTEM LED (D1): Internal watchdog timer (blink each second)
  - SYSTEM FAULT (D2): Active in case of hardware check routine failure
  - BEACON RADIO UPLINK (D3): Blink when a Uplink is received
  - BEACON RADIO DOWNLINK (D3): Blink when a Downlink is sent
- Project:
- SpaceLab - Federal University of Santa Catarina
- Title:
- Engineer:
- Project Code:
- Date:
- Revision:
- Sheet
- of
- Size:
- A3
- (in symbol Cap_Cer_X7R_0.1uF_25V_0805) .
- (in symbol Cap_Cer_X7R_0.01uF_25V_0805) .
- (in symbol Cap_Cer_X7R_0.47uF_50V_0805) .
- (in symbol Cap_Cer_X7R_1nF_16V_0603) .
- (in symbol Cap_Cer_X7R_10pF_100V_0805) .
- (in symbol Cap_Cer_X7R_12pF_50V_0805) .
- (in symbol Cap_Tant_SMD_10uF_10V_0805) +
- (in symbol LED/G_0805) Green
- (in symbol LED/O_0805) Orange
- (in symbol Xtal_32.768kHz_12pF_2_SMD) .

### Library data of the parts
C1 = Cap_Cer_X7R_0.47uF_50V_0805: CAP CER 0.47UF 50V 10% X7R 0805; Partnumber: C0805C474K5RACTU; NCM: 8532.24.10
C2 C3 = Cap_Cer_X7R_10pF_100V_0805: CAP CER 10pF 100V 0805; Partnumber: 08051A100FAT2A; NCM: 8532.24.10
C4 C5 = Cap_Cer_X7R_12pF_50V_0805: CAP CER 12pF 50V 0805; Partnumber: CL21C120FBANNNC; NCM: 8532.24.10
C6 = Cap_Cer_X7R_1nF_16V_0603: CAP CER 1nF 16V 0603 5%; Partnumber: C0603X102J4RECAUTO; NCM: 8532.24.10
C7 C9 C11 C13 C15 C18 = Cap_Tant_SMD_10uF_10V_0805: CAP Tantalum 10uF 10V 20% 0805; Partnumber: TPSP106M010R2000; NCM: 8532.21.11
C8 C10 C12 C14 C16 C17 C19 C20 = Cap_Cer_X7R_0.1uF_25V_0805: CAP CER 0.1UF 25V 10% X7R 0805; Partnumber: CC0805KRX7R8BB104; NCM: 8532.24.10
C21 = Cap_Cer_X7R_0.01uF_25V_0805: CAP CER 0.01uF 25V 10% X7R 0805; Partnumber: CL21B103KAANNNC; NCM: 8532.24.10
D1-D4 = LED/O_0805: LED Orange SMD - Orange 605nm LED Indication - Discrete 2V 0805 (2012 Metric); Partnumber: LTST-C170KFKT; NCM: 8541.40.21
D5 = LED/G_0805: LED Green SMD - Green 569nm LED Indication - Discrete 2.1V 0805 (2012 Metric); NCM: 8541.40.21; Partnumber: LTST-C171GKT
J_V0 = R0R_JUMPER_1/8W_0805: as J_P4 on sheet 1_interface; NCM: 8533.21.20
R1 = R47k_1%_1/8W_0805: RES 47k OHM 1/8W 1% 0805; Partnumber: RC0805FR-0747KL; NCM: 8533.21.20
R2-R6 = R1.0k_1%_1/8W_0805: RES 1.0K OHM 1/8W 1% 0805; Partnumber: RC0805FR-071KL; NCM: 8533.21.20
R7-R11 R13-R17 = R10k_1%_1/8W_0805: RES 10K OHM 1/8W 1%  0805; Partnumber: CRCW080510K0FKEA; NCM: 8533.21.20
RS1 RS2 = R0.1R_1%_1/3W_0805: RES 0.1R OHM 1/3W 1% 0805; Partnumber: SR732ATTER100F; NCM: 8533.21.20
TP1-TP4 = TEST_POINT: Test point
U2 = MSP430F6659IPZR: CPUXV2 series Microcontroller IC 16-Bit 20MHz 512KB (512K x 8) FLASH 100-LQFP (14x14); Manufacturer: Texas Instruments; PIN_COUNT: 100; Application_BuildNumber: *; PartNumber: MSP430F6659IPZR; Alternate PartNumber: MSP430F6659IPZ; PackageReference: PZ0100A; MountType: SMT; CompType: IC; RoHS: Y; RefDes: RefDes; Type: DEV; Value: Value
U3 = CMP-0338-00011-2: Processor Supervisory Circuit, 1 Supply Monitored, -40 to 85 degC, 5-Pin SOT-23 (DBV), Green (RoHS & no Sb/Br); Manufacturer: Texas Instruments; Iq: 15 uA Typ.; Threshold Voltage: 2.93 V Typ.; Watchdog Timer WDI: 0.2 s; VCC: 1.1 V Min.; Reset Threshold Accuracy: 2.4%; Rating: Catalog; Time Delay: 25 ms; # of Supplies Monitored: 1; Output Driver Type / Reset Output: Active-low, Push-pull; Packing: Tape and Reel; ComponentLink1Description: Manufacturer URL; RoHS: TRUE; PackageDescription: 5-Pin Plastic Small Outline, Body 1.6 x 2.9 mm, Pitch 0.95 mm; Mounting Technology: Surface Mount; ComponentLink1URL: www.ti.com; PackageReference: DBV0005A; ComponentLink3URL: http://www.ti.com/lit/ml/mpds018j/mpds018j.pdf; ComponentLink3Description: Package Specification; PartNumber: TPS3823-33QDBVRQ1; DatasheetVersion: SLVS165J; ComponentLink2Description: Datasheet; PackageVersion: 4073253-4/L; ComponentLink2URL: http://www.ti.com/lit/ds/symlink/tps3820-33.pdf; Operating Temperature Range: -40 to 85 degC
U4 U5 = INA226AQDGSRQ1: High-Side Measurement, Bi-Directional Current/Power Monitor w/I2C Interface; Manufacturer: Texas Instruments; GENERIC_PART_NUMBER: INA226; INDUSTRY_STD_PKG_TYPE: MSOP; FAMILY_NAME: CURRENT SHUNT MONITOR; PIN_COUNT: 10; PACKAGE_DESIGNATOR: DGS; Datasheet_URL: http://www.ti.com/lit/gpn/INA226; Vendor: Texas Instruments; Manufacturer_Part_Number: INA226AQDGSRQ1; Copyright: Copyright (C) 2018 Accelerated Designs. All rights reserved; RefDes: RefDes; Type: DEV; Partnumber: INA226AQDGSRQ1
U6 = TCA4311ADR: IC SIGNAL BUFFER I2C 8SOIC HOTSWAP; Partnumber: TCA4311ADR
Y2 = XTAL_32MHz_SMD_4-SMD: 32MHz ±10ppm Crystal 10pF 60 Ohm -40°C ~ 125°C; Partnumber: ABM8X-102-32.000MHZ-T; NCM: 8541.60.10
Y3 = Xtal_32.768kHz_12pF_2_SMD: 32.768kHz ±20ppm Crystal 12.5pF 70 kOhm -40°C ~ 125°C; Partnumber: ECS-.327-12.5-34S-TR; NCM: 8541.60.10

## Sheet 5_radio_0.schdoc: Radio 0
size A4; DrawnBy: Sara Vega Martinez; Revision: v0.1; SheetNumber: 5; SheetTotal: 6; ProjectCode: TTC2; DesignedBy: André M. P. Mattos
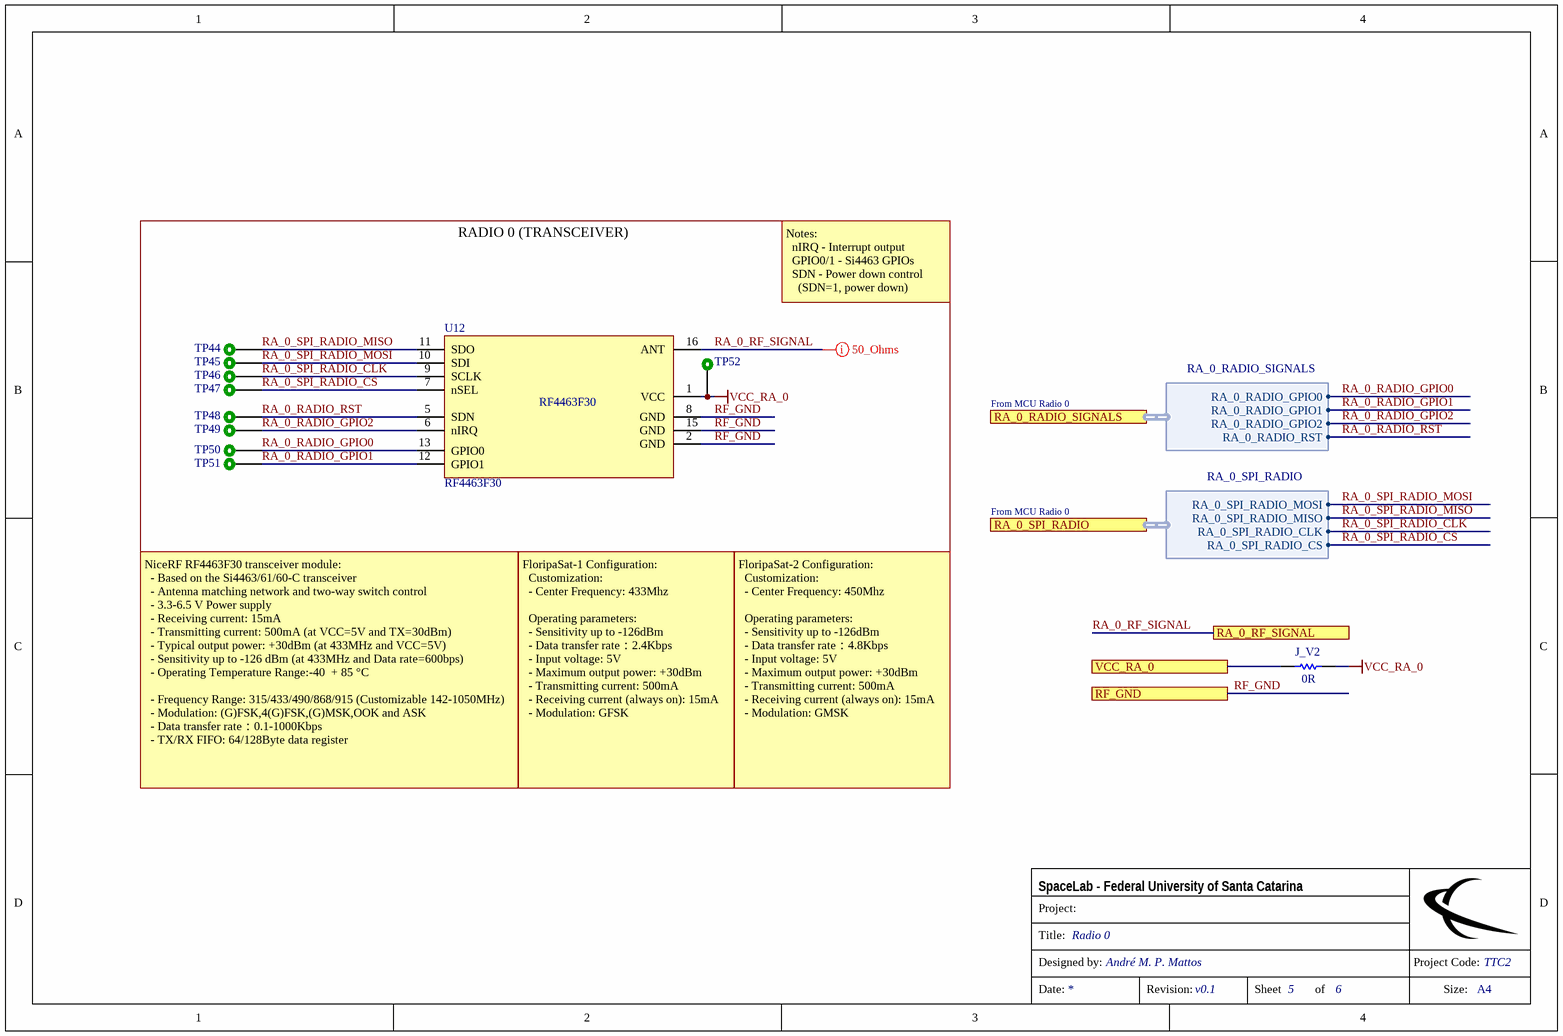
[diagram p4: 5_radio_0.schdoc]

### Parts
J_V2  0R  [0805]
TP44  TEST_POINT  [TEST_POINT_2]  (value not drawn)  (no BOM)
TP45  TEST_POINT  [TEST_POINT_2]  (value not drawn)  (no BOM)
TP46  TEST_POINT  [TEST_POINT_2]  (value not drawn)  (no BOM)
TP47  TEST_POINT  [TEST_POINT_2]  (value not drawn)  (no BOM)
TP48  TEST_POINT  [TEST_POINT_2]  (value not drawn)  (no BOM)
TP49  TEST_POINT  [TEST_POINT_2]  (value not drawn)  (no BOM)
TP50  TEST_POINT  [TEST_POINT_2]  (value not drawn)  (no BOM)
TP51  TEST_POINT  [TEST_POINT_2]  (value not drawn)  (no BOM)
TP52  TEST_POINT  [TEST_POINT_2]  (value not drawn)  (no BOM)
U12  RF4463F30  [RF4463F30]

### Blocks framed on the sheet
RADIO 0 (TRANSCEIVER): TP44-TP52 U12

### Ports
RA_0_RADIO_SIGNALS (harness RA_0_RADIO_SIGNALS), RA_0_RF_SIGNAL, RA_0_SPI_RADIO (harness RA_0_SPI_RADIO), RF_GND, VCC_RA_0

### Harnesses
RA_0_RADIO_SIGNALS: RA_0_RADIO_GPIO2, RA_0_RADIO_RST, RA_0_RADIO_GPIO0, RA_0_RADIO_GPIO1
RA_0_SPI_RADIO: RA_0_SPI_RADIO_CLK, RA_0_SPI_RADIO_MISO, RA_0_SPI_RADIO_MOSI, RA_0_SPI_RADIO_CS

### Nets
RA_0_SENSE_VCC_OUT1: J_V2.2 ; port VCC_RA_0
VCC_RA_0: J_V2.1 TP52.1 U12.1(VCC)
RA_0_RADIO_GPIO0: TP50.1 U12.13(GPIO0) ; port RA_0_RADIO_SIGNALS.RA_0_RADIO_GPIO0
RA_0_RADIO_GPIO1: TP51.1 U12.12(GPIO1) ; port RA_0_RADIO_SIGNALS.RA_0_RADIO_GPIO1
RA_0_RADIO_GPIO2: TP49.1 U12.6(nIRQ) ; port RA_0_RADIO_SIGNALS.RA_0_RADIO_GPIO2
RA_0_RADIO_RST: TP48.1 U12.5(SDN) ; port RA_0_RADIO_SIGNALS.RA_0_RADIO_RST  [project net RA_0_RADIO_GPIO3]
RA_0_RF_SIGNAL: U12.16(ANT) ; port RA_0_RF_SIGNAL
RA_0_SPI_RADIO_CLK: TP46.1 U12.9(SCLK) ; port RA_0_SPI_RADIO.RA_0_SPI_RADIO_CLK
RA_0_SPI_RADIO_CS: TP47.1 U12.7(nSEL) ; port RA_0_SPI_RADIO.RA_0_SPI_RADIO_CS
RA_0_SPI_RADIO_MISO: TP44.1 U12.11(SDO) ; port RA_0_SPI_RADIO.RA_0_SPI_RADIO_MISO
RA_0_SPI_RADIO_MOSI: TP45.1 U12.10(SDI) ; port RA_0_SPI_RADIO.RA_0_SPI_RADIO_MOSI
RF_GND: U12.2(GND) U12.8(GND) U12.15(GND) ; port RF_GND

### Layout directives
net class 50Ohm_Net: RA_0_RF_SIGNAL

### Notes on the sheet
- Notes:
  nIRQ - Interrupt output
  GPIO0/1 - Si4463 GPIOs
  SDN - Power down control
  (SDN=1, power down)
- From MCU Radio 0
- NiceRF RF4463F30 transceiver module:
  - Based on the Si4463/61/60-C transceiver
  - Antenna matching network and two-way switch control
  - 3.3-6.5 V Power supply
  - Receiving current: 15mA
  - Transmitting current: 500mA (at VCC=5V and TX=30dBm)
  - Typical output power: +30dBm (at 433MHz and VCC=5V)
  - Sensitivity up to -126 dBm (at 433MHz and Data rate=600bps)
  - Operating Temperature Range:-40  + 85 °C
  - Frequency Range: 315/433/490/868/915 (Customizable 142-1050MHz)
  - Modulation: (G)FSK,4(G)FSK,(G)MSK,OOK and ASK
  - Data transfer rate：0.1-1000Kbps
  - TX/RX FIFO: 64/128Byte data register
- FloripaSat-1 Configuration:
  Customization:
  - Center Frequency: 433Mhz
  Operating parameters:
  - Sensitivity up to -126dBm
  - Data transfer rate：2.4Kbps
  - Input voltage: 5V
  - Maximum output power: +30dBm
  - Transmitting current: 500mA
  - Receiving current (always on): 15mA
  - Modulation: GFSK
- FloripaSat-2 Configuration:
  Customization:
  - Center Frequency: 450Mhz
  Operating parameters:
  - Sensitivity up to -126dBm
  - Data transfer rate：4.8Kbps
  - Input voltage: 5V
  - Maximum output power: +30dBm
  - Transmitting current: 500mA
  - Receiving current (always on): 15mA
  - Modulation: GMSK
- Project:
- SpaceLab - Federal University of Santa Catarina
- Title:
- Designed by:
- Project Code:
- Date:
- Revision:
- Sheet
- of
- Size:
- A4

### Library data of the parts
J_V2 = R0R_JUMPER_1/16W_0805: RES 0R OHM 1/16W JUMPER 0805; Partnumber: CRCW08050000Z0EA; NCM: 8533.21.20
TP44-TP52 = TEST_POINT: Test point
U12 = RF4463F30: RF4463F30 High Power Wireless Transceiver Module; Partnumber: RF4463F30